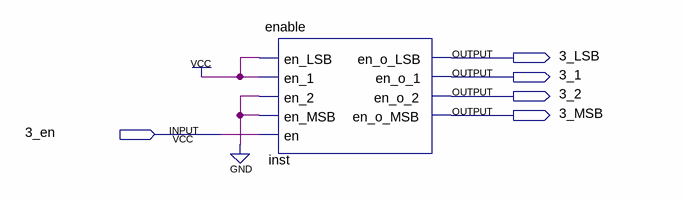
[diagram p0: schematic sheet]
// Quartus schematic 3_en.bdf as structural Verilog: 1 symbols, 5 pins
module \3_en  (
  input  \3_en ,
  output \3_LSB ,
  output \3_1 ,
  output \3_2 ,
  output \3_MSB 
);

  enable inst (
    .en_LSB(1'b1), .en_1(1'b1), .en_2(1'b0), .en_MSB(1'b0), .en(\3_en ), .en_o_LSB(\3_LSB ), .en_o_1(\3_1 ),
    .en_o_2(\3_2 ), .en_o_MSB(\3_MSB ));
endmodule
